# Altium schematic sheet 2_Other.schdoc
size 309 x 223 mm; Symbol: Sheet-Symbol_A4; Device: Sheet-Symbol_A4; Company: 嘉立创EDA; Version: V1.0; Page Size: A4; @Project Name: MyESP32CardReader; @Page Count: 2; @Update Date: 2024-10-07; @Create Date: 2024-08-08; @Schematic Name: Schematic1; @Page No: 2; @Page Name: Other; @Board Name: Board1; @Create Time: 18:35:55; @Update Time: 22:18:51
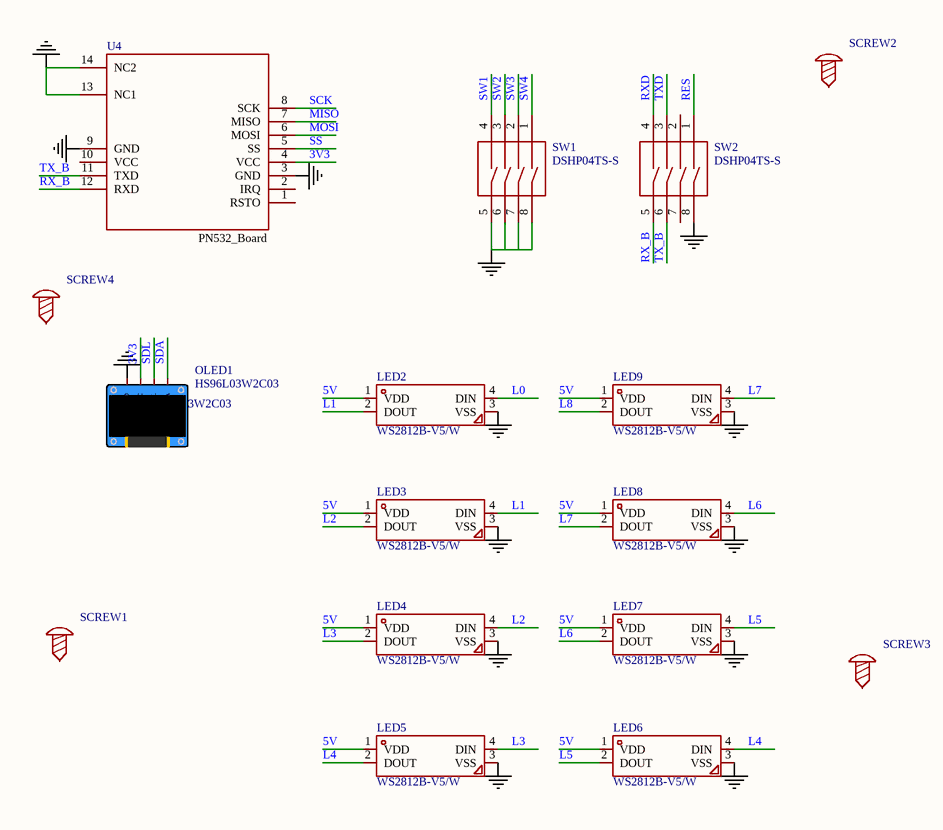
[diagram p0: 2_Other.schdoc]

## Parts
LED2  WS2812B-V5/W  [LED-SMD_4P-L5.0-W5.0-TL-1]  (value not drawn)
LED3  WS2812B-V5/W  [LED-SMD_4P-L5.0-W5.0-TL-1]  (value not drawn)
LED4  WS2812B-V5/W  [LED-SMD_4P-L5.0-W5.0-TL-1]  (value not drawn)
LED5  WS2812B-V5/W  [LED-SMD_4P-L5.0-W5.0-TL-1]  (value not drawn)
LED6  WS2812B-V5/W  [LED-SMD_4P-L5.0-W5.0-TL-1]  (value not drawn)
LED7  WS2812B-V5/W  [LED-SMD_4P-L5.0-W5.0-TL-1]  (value not drawn)
LED8  WS2812B-V5/W  [LED-SMD_4P-L5.0-W5.0-TL-1]  (value not drawn)
LED9  WS2812B-V5/W  [LED-SMD_4P-L5.0-W5.0-TL-1]  (value not drawn)
OLED1  HS96L03W2C03  [OLED-TH_L27.8-W27.2-P2.54_C9900033791]
SCREW1  M2螺丝  [M2螺丝]  (value not drawn)
SCREW2  M2螺丝  [M2螺丝]  (value not drawn)
SCREW3  M2螺丝  [M2螺丝]  (value not drawn)
SCREW4  M2螺丝  [M2螺丝]  (value not drawn)
SW1  DSHP04TS-S  [SW-SMD_8P-L6.7-W5.4-P1.27-LS8.5]  (value not drawn)
SW2  DSHP04TS-S  [SW-SMD_8P-L6.7-W5.4-P1.27-LS8.5]  (value not drawn)
U4  PN532_Board  [PN532_Board]  (value not drawn)

## Nets
GND: LED2.3(VSS) LED3.3(VSS) LED4.3(VSS) LED5.3(VSS) LED6.3(VSS) LED7.3(VSS) LED8.3(VSS) LED9.3(VSS) OLED1.1(GND) SW1.5 SW1.6 SW1.7 SW1.8 SW2.8 U4.3(GND) U4.9(GND) U4.13(NC1) U4.14(NC2)
3V3: OLED1.2(VCC) U4.4(VCC)
5V: LED2.1(VDD) LED3.1(VDD) LED4.1(VDD) LED5.1(VDD) LED6.1(VDD) LED7.1(VDD) LED8.1(VDD) LED9.1(VDD)
L0: LED2.4(DIN)
L1: LED2.2(DOUT) LED3.4(DIN)
L2: LED3.2(DOUT) LED4.4(DIN)
L3: LED4.2(DOUT) LED5.4(DIN)
L4: LED5.2(DOUT) LED6.4(DIN)
L5: LED6.2(DOUT) LED7.4(DIN)
L6: LED7.2(DOUT) LED8.4(DIN)
L7: LED8.2(DOUT) LED9.4(DIN)
L8: LED9.2(DOUT)
MISO: U4.7(MISO)
MOSI: U4.6(MOSI)
RES: SW2.1
RX_B: SW2.5 U4.12(RXD)
RXD: SW2.4
SCK: U4.8(SCK)
SDA: OLED1.4(SDA)
SDL: OLED1.3(SCL)
SS: U4.5(SS)
SW1: SW1.4
SW2: SW1.3
SW3: SW1.2
SW4: SW1.1
TX_B: SW2.6 U4.11(TXD)
TXD: SW2.3

Not connected (* = marked no-connect by the designer): SCREW1 1; SCREW2 1; SCREW3 1; SCREW4 1; SW2 2 7; U4 1(RSTO) 2(IRQ) 10(VCC)

## Notes on the sheet
- 1
- 2
- 3
- 4
- 5
- 6
- A
- B
- C
- 原理图
- Schematic1
- 创建日期
- 更新日期
- 2024-10-07
- 2024-08-08
- 审阅
- 绘制
- 图页
- Other
- 物料编码
- MyESP32CardReader
- D
- 版本
- 尺寸
- 页
- 共
- V1.0
- A4
- 嘉立创EDA

## Library data of the parts
LED2-LED9 = WS2812B-V5/W: 无需外围元器件，有反接保护和过压保护，游乐设备，消费类电子，电竞领域，电脑周边及设备; Manufacturer: worldsemi; Symbol: WS2812B-V5_C2846931; Add into BOM: yes; Device: WS2812B-V5/W; LCSC Part Name: RGB三色; Supplier Part: C2874885; Manufacturer Part: WS2812B-V5/W; Supplier Footprint: SMD5050; JLCPCB Part Class: Extended Part; Datasheet: https://atta.szlcsc.com/upload/public/pdf/source/20220607/7C249E7978D02183621563743847A955.pdf; Supplier: LCSC; Convert to PCB: yes
OLED1 = HS96L03W2C03: 主控芯片:SSD1315;接口类型:I2C;尺寸(inch):0.96;像素分辨率:128x64;; Manufacturer: HS(汉昇); Symbol: 0.96OLED模块_4P; Add into BOM: yes; Interface Type: I2C; Pixel Resolution: 128x64; Device: HS96L03W2C03; LCSC Part Name: 0.96寸OLED显示屏窄白光IIC; Supplier Part: C5248080; Manufacturer Part: HS96L03W2C03; Supplier Footprint: -; JLCPCB Part Class: Extended Part; Datasheet: https://atta.szlcsc.com/upload/public/pdf/source/20230627/763D01F79A90007632F098068C7C8AD9.pdf; Supplier: LCSC; Convert to PCB: yes; Main Control Chip: SSD1315; Size: 0.96; Operating Temperature: -40℃~+70℃
SCREW1-SCREW4 = M2螺丝: Symbol: 螺丝孔; Convert to PCB: yes; Check: false; Device: M2螺丝; Add into BOM: yes; Supplier Footprint: 插件
SW1 SW2 = DSHP04TS-S: 类型:平拨,凹槽式;电路结构:单刀单掷;开关位数:4位;额定电流:25mA;额定电压:24V;使用寿命:3千次;颜色:黑色;; Manufacturer: XKB Connectivity(中国星坤); Add into BOM: yes; Circuit: 单刀单掷; Number of Positions: 4位; Pin Style: 鸥翼型; Current Rating: 25mA; Voltage Rating: 24V; Operating Life: 3千次; Symbol: DSHP04TS-S; Device: DSHP04TS-S; Supplier: LCSC; Supplier Part: C319050; Manufacturer Part: DSHP04TS-S; JLCPCB Part Class: 扩展库; LCSC Part Name: 间距1.27mm 平拨,凹槽式 4位拨码开关; Supplier Footprint: SMD-8P,5.4x6.7mm; Datasheet: https://atta.szlcsc.com/upload/public/pdf/source/20211009/11BE85C99D2C85B0991AF4F9D6EB8BDE.pdf; Convert to PCB: yes; Type: 平拨,凹槽式; Lead Pitch: 1.27mm; Operating Temperature: -20℃~+70℃; Color: 黑色
U4 = PN532_Board: Add into BOM: yes; Check: false; Symbol: PN532_Board; Device: PN532_Board; Convert to PCB: yes